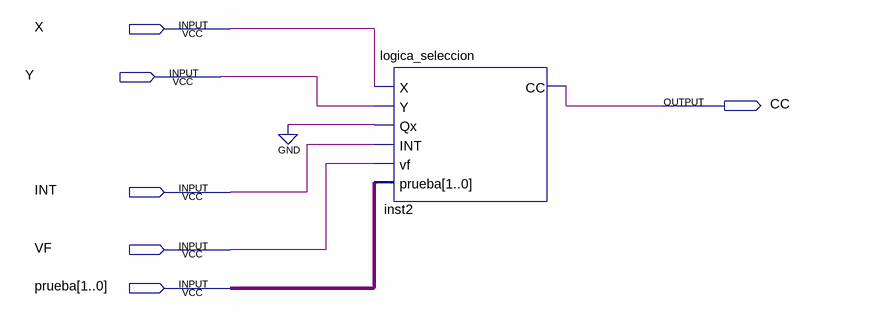
[diagram p0: schematic sheet]
// Quartus schematic logsel.bdf as structural Verilog: 1 symbols, 6 pins
module logsel (
  input  X,
  input  Y,
  input  INT,
  input  VF,
  input  [1:0] prueba,
  output CC
);

  logica_seleccion inst2 (.X(X), .Y(Y), .Qx(1'b0), .INT(INT), .vf(VF), .prueba(prueba), .CC(CC));
endmodule
